# Altium schematic sheet 200_FLASH_AND_UART.SchDoc
size A; SheetNumber: 3; SheetTotal: 4
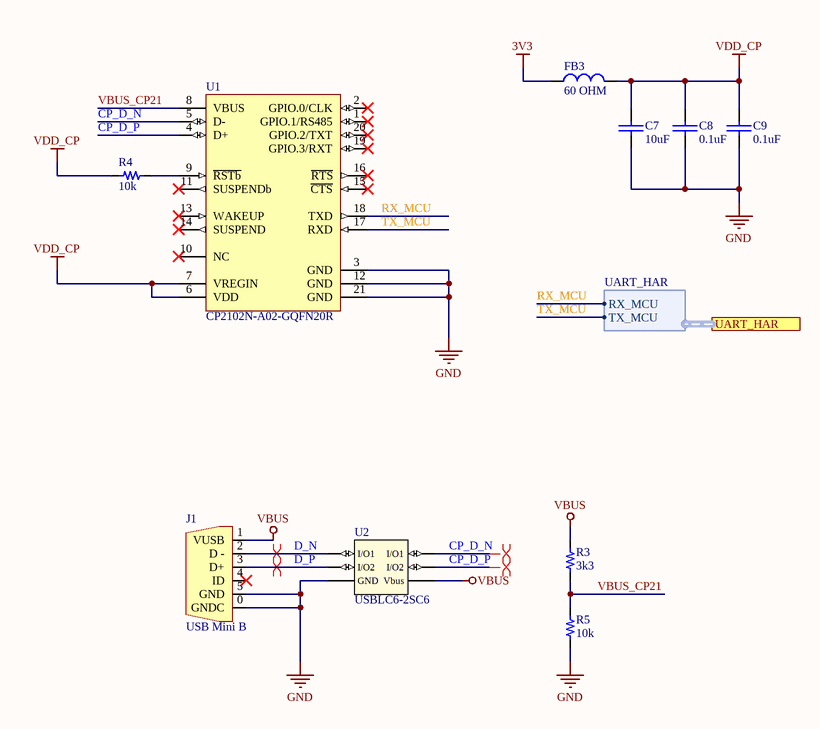
[diagram p0: 200_FLASH_AND_UART.SchDoc]

## Parts
C7  value 10uF  [0603_cap]  (hidden comment: 10uF 10V)
C8  value 0.1uF  [0603_cap]  (hidden comment: 0.1uF 50V)
C9  value 0.1uF  [0603_cap]  (hidden comment: 0.1uF 50V)
FB3  value 60 OHM  [0603_fb]  (hidden comment: 60OHM 2A)
J1  USB Mini B  [CON_5x1_SMD_miniUSB_B]
R3  value 3k3  [0603_res]  (hidden comment: 3k3 1/10W)
R4  value 10k  [0603_res]  (hidden comment: 10k 1/10W)
R5  value 10k  [0603_res]  (hidden comment: 10k 1/10W)
U1  CP2102N-A02-GQFN20R  [WFQFN_20_EP_3X3MM]
U2  USBLC6-2SC6  [SOT_23_6]

## Ports
UART_HAR (harness UART_HAR, see Main[2A], 000_MCU[6C])

## Harnesses
UART_HAR: RX_MCU, TX_MCU

## Nets
3V3: FB3.1
GND: C7.2 C8.2 C9.2 J1.0(GNDC) J1.5(GND) R5.1 U1.3(GND) U1.12(GND) U1.21(GND) U2.2(GND)
VBUS: J1.1(VUSB) R3.2 U2.5(Vbus)
VDD_CP: C7.1 C8.1 C9.1 FB3.2 R4.2 U1.6(VDD) U1.7(VREGIN)
CP_D_N: U1.5(D-) U2.6(I/O1)
CP_D_P: U1.4(D+) U2.4(I/O2)
D_N: J1.2(D_-) U2.1(I/O1)
D_P: J1.3(D+) U2.3(I/O2)
RX_MCU: U1.18(TXD) ; port UART_HAR.RX_MCU
TX_MCU: U1.17(RXD) ; port UART_HAR.TX_MCU
VBUS_CP21: R3.1 R5.2 U1.8(VBUS)
NetR4_1: R4.1 U1.9(~{RSTb})

Not connected (* = marked no-connect by the designer): J1 4(ID)*; U1 1(GPIO.1/RS485)* 2(GPIO.0/CLK)* 10(NC)* 11(SUSPENDb)* 13(WAKEUP)* 14(SUSPEND)* 15(~{CTS})* 16(~{RTS})* 19(GPIO.3/RXT)* 20(GPIO.2/TXT)*

## Layout directives
differential pair: CP_D_N, CP_D_P, D_N, D_P

## Library data of the parts
C7 = Cap_10uF_0603_10V: 10V 10uF X5R ±10% 0603 Multilayer Ceramic Capacitors MLCC - SMD/SMT ROHS; Manufacturer: CCTC; Manufacturer Part Number: TCC0603X5R106K100CT; Supplier 1: LCSC; Supplier Part Number 1: C380314; ComponentLink1Description: LCSC; ComponentLink1URL: https://www.lcsc.com/product-detail/Multilayer-Ceramic-Capacitors-MLCC-SMD-SMT_CCTC-TCC0603X5R106K100CT_C380314.html
C8 C9 = Cap_0.1uF_0603_50V: 50V 100nF Y5V -20%~+80% 0603 Multilayer Ceramic Capacitors MLCC - SMD/SMT ROHS; Manufacturer: Walsin Tech Corp; Manufacturer Part Number: 0603F104Z500CT; Supplier 1: LCSC; Supplier Part Number 1: C83060; ComponentLink1Description: LCSC; ComponentLink1URL: https://www.lcsc.com/product-detail/Multilayer-Ceramic-Capacitors-MLCC-SMD-SMT_Walsin-Tech-Corp-0603F104Z500CT_C83060.html
FB3 = FB_60_0603_2A: 2A 1 100mΩ 60Ω@100MHz ±25% 0603 Ferrite Beads ROHS; Manufacturer: TAI-TECH; Manufacturer Part Number: HCB1608KF-600T20; ComponentLink1Description: LCSC; ComponentLink1URL: https://www.lcsc.com/product-detail/Ferrite-Beads_TAI-TECH-HCB1608KF-600T20_C369516.html; Supplier 1: LCSC; Supplier Part Number 1: C369516
J1 = Con_Mini_USB_B: CONN RCPT USB2.0 MINI B SMD R/A; Manufacturer Part Number: KH-MINI-SMT-5P-Cu; Manufacturer: EDAC Inc.; ComponentLink1Description: LCSC; ComponentLink1URL: https://datasheet.lcsc.com/lcsc/2106070035_Shenzhen-Kinghelm-Elec-KH-MINI-SMT-5P-Cu_C2688795.pdf; Supplier 1: LCSC; Supplier Part Number 1: C2688795
R3 = Res_3k3_0603_1/10W: RES SMD 3k3 OHM 5% 1/10W 0603; Manufacturer: FOJAN; Manufacturer Part Number: FRC0603J332 TS; ComponentLink1URL: https://www.lcsc.com/product-detail/Chip-Resistor-Surface-Mount_FOJAN-FRC0603J332-TS_C2907140.html; Supplier 1: LCSC; Supplier Part Number 1: C2907140; ComponentLink1Description: LCSC
R4 R5 = Res_10k_0603_1/10W: RES SMD 10k OHM 5% 1/10W 0603; Manufacturer: FOJAN; Manufacturer Part Number: FRC0603J103TS; ComponentLink1URL: https://www.lcsc.com/product-detail/Chip-Resistor-Surface-Mount_FOJAN-FRC0603J103TS_C2930027.html; Supplier 1: LCSC; Supplier Part Number 1: C2930027; ComponentLink1Description: LCSC
U1 = IC_SGL_USB2UART-BRIDGE_20QFN: IC USB TO UART BRIDGE QFN20; Manufacturer: Silicon Labs; Manufacturer Part Number: CP2102N-A02-GQFN20R; Supplier 1: LCSC; Supplier Part Number 1: C969913; ComponentLink1Description: LCSC; ComponentLink1URL: https://www.lcsc.com/product-detail/USB-ICs_SILICON-LABS-CP2102N-A02-GQFN20R_C969913.html
U2 = TVS_5.25V_2CH_SOT_23_6: TVS DIODE 5.25V 17V SOT23-6; Manufacturer: STMicroelectronics; ComponentLink1Description: LCSC; ComponentLink1URL: https://www.lcsc.com/product-detail/ESD-Protection-Devices_STMicroelectronics-USBLC6-2SC6_C7519.html; Supplier 1: LCSC; Manufacturer Part Number: USBLC6-2SC6; Supplier Part Number 1: C7519